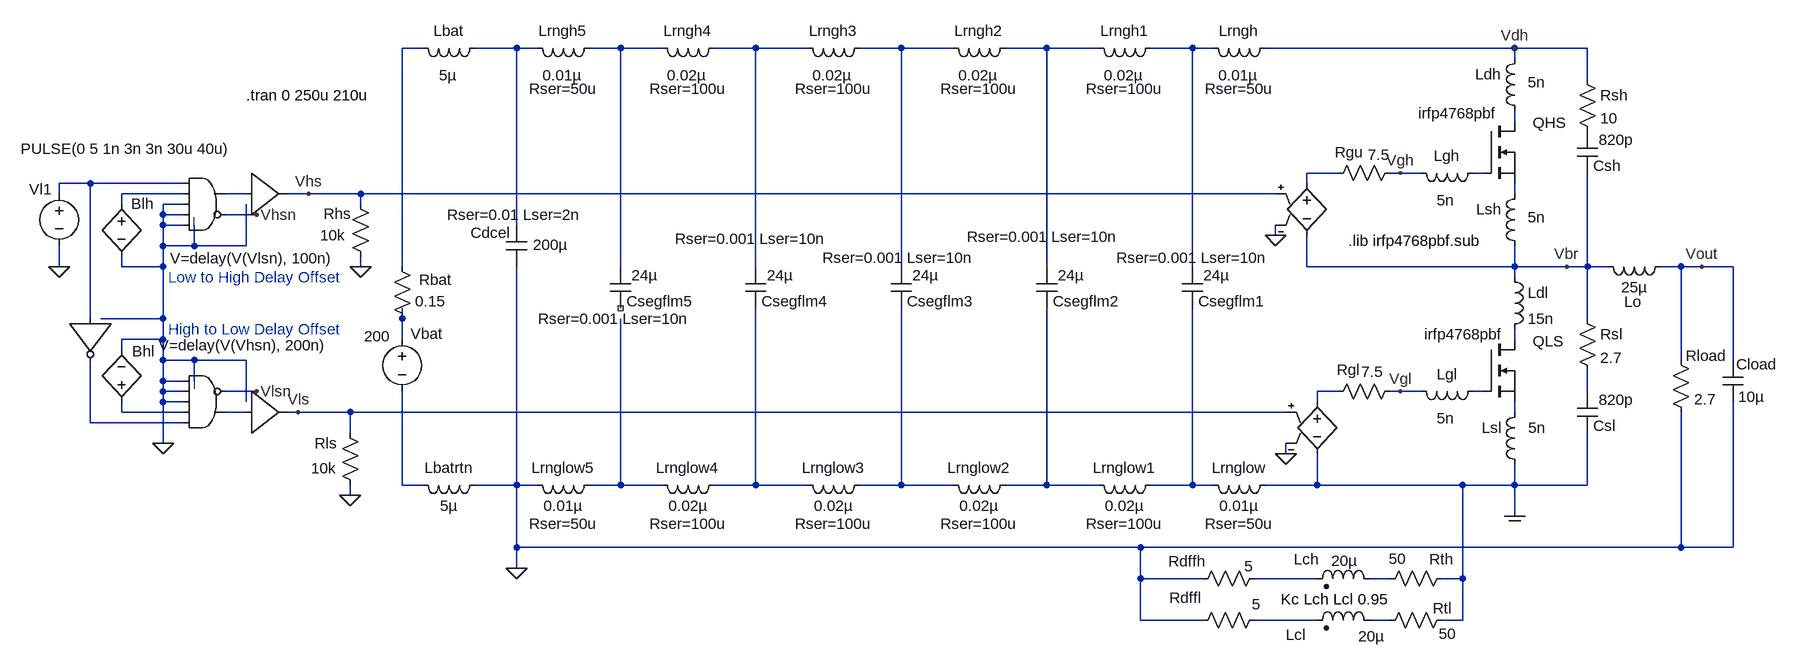
[diagram p0: schematic ETdcdcGM.asc]
ETdcdcGM.asc, the LTspice schematic file:
Version 4
SHEET 1 880 884
WIRE -3024 -240 -3056 -240
WIRE -2880 -240 -2944 -240
WIRE -2848 -240 -2880 -240
WIRE -2720 -240 -2768 -240
WIRE -2656 -240 -2720 -240
WIRE -2512 -240 -2576 -240
WIRE -2432 -240 -2512 -240
WIRE -2288 -240 -2352 -240
WIRE -2208 -240 -2288 -240
WIRE -2064 -240 -2128 -240
WIRE -1984 -240 -2064 -240
WIRE -1840 -240 -1904 -240
WIRE -1808 -240 -1840 -240
WIRE -1344 -240 -1728 -240
WIRE -1232 -240 -1344 -240
WIRE -1344 -224 -1344 -240
WIRE -1232 -192 -1232 -240
WIRE -1344 -128 -1344 -144
WIRE -1616 -48 -1664 -48
WIRE -1520 -48 -1536 -48
WIRE -1488 -48 -1520 -48
WIRE -1392 -48 -1408 -48
WIRE -3536 -32 -3584 -32
WIRE -3392 -32 -3536 -32
WIRE -1664 -32 -1664 -48
WIRE -3584 -16 -3584 -32
WIRE -3392 -16 -3488 -16
WIRE -3296 -16 -3328 -16
WIRE -3200 -16 -3232 -16
WIRE -3120 -16 -3200 -16
WIRE -1712 -16 -3120 -16
WIRE -1344 -16 -1344 -32
WIRE -3488 0 -3488 -16
WIRE -3392 0 -3424 0
WIRE -3120 0 -3120 -16
WIRE -3424 16 -3424 0
WIRE -3392 16 -3424 16
WIRE -3280 16 -3328 16
WIRE -3424 32 -3424 16
WIRE -3392 32 -3424 32
WIRE -2880 32 -2880 -240
WIRE -1712 48 -1712 32
WIRE -3424 64 -3424 32
WIRE -3376 64 -3376 32
WIRE -3376 64 -3424 64
WIRE -3296 64 -3296 0
WIRE -3296 64 -3376 64
WIRE -3584 96 -3584 64
WIRE -3488 96 -3488 80
WIRE -3424 96 -3424 64
WIRE -3424 96 -3488 96
WIRE -3120 96 -3120 80
WIRE -3056 96 -3056 -240
WIRE -2720 96 -2720 -240
WIRE -2512 96 -2512 -240
WIRE -2288 96 -2288 -240
WIRE -2064 96 -2064 -240
WIRE -1840 96 -1840 -240
WIRE -1664 96 -1664 48
WIRE -1344 96 -1344 64
WIRE -1344 96 -1664 96
WIRE -1264 96 -1344 96
WIRE -1232 96 -1232 -48
WIRE -1232 96 -1264 96
WIRE -1200 96 -1232 96
WIRE -1088 96 -1120 96
WIRE -1056 96 -1088 96
WIRE -1008 96 -1056 96
WIRE -1344 112 -1344 96
WIRE -3536 176 -3536 -32
WIRE -3424 176 -3424 96
WIRE -3424 176 -3520 176
WIRE -3056 176 -3056 160
WIRE -1232 176 -1232 96
WIRE -3424 208 -3424 176
WIRE -3424 208 -3488 208
WIRE -3056 208 -3056 176
WIRE -1344 208 -1344 192
WIRE -3488 224 -3488 208
WIRE -3424 240 -3424 208
WIRE -3376 240 -3424 240
WIRE -3296 240 -3376 240
WIRE -1088 240 -1088 96
WIRE -1008 240 -1008 96
WIRE -3424 272 -3424 240
WIRE -3392 272 -3424 272
WIRE -3376 272 -3376 240
WIRE -3424 288 -3424 272
WIRE -3392 288 -3424 288
WIRE -3280 288 -3328 288
WIRE -1616 288 -1648 288
WIRE -1520 288 -1536 288
WIRE -1488 288 -1520 288
WIRE -1392 288 -1408 288
WIRE -1232 288 -1232 256
WIRE -3424 304 -3424 288
WIRE -3392 304 -3424 304
WIRE -3296 304 -3296 240
WIRE -1648 304 -1648 288
WIRE -3488 320 -3488 304
WIRE -3392 320 -3488 320
WIRE -3296 320 -3328 320
WIRE -3216 320 -3232 320
WIRE -3136 320 -3216 320
WIRE -1696 320 -3136 320
WIRE -1344 320 -1344 304
WIRE -3536 336 -3536 240
WIRE -3392 336 -3536 336
WIRE -3136 352 -3136 320
WIRE -3424 368 -3424 304
WIRE -1696 384 -1696 368
WIRE -3056 432 -3056 288
WIRE -3024 432 -3056 432
WIRE -2880 432 -2880 96
WIRE -2880 432 -2944 432
WIRE -2848 432 -2880 432
WIRE -2720 432 -2720 176
WIRE -2720 432 -2768 432
WIRE -2656 432 -2720 432
WIRE -2512 432 -2512 160
WIRE -2512 432 -2576 432
WIRE -2432 432 -2512 432
WIRE -2288 432 -2288 160
WIRE -2288 432 -2352 432
WIRE -2208 432 -2288 432
WIRE -2064 432 -2064 160
WIRE -2064 432 -2128 432
WIRE -1984 432 -2064 432
WIRE -1840 432 -1840 160
WIRE -1840 432 -1904 432
WIRE -1808 432 -1840 432
WIRE -1648 432 -1648 384
WIRE -1648 432 -1728 432
WIRE -1424 432 -1648 432
WIRE -1344 432 -1344 400
WIRE -1344 432 -1424 432
WIRE -1232 432 -1232 352
WIRE -1232 432 -1344 432
WIRE -3136 448 -3136 432
WIRE -1344 480 -1344 432
WIRE -2880 528 -2880 432
WIRE -1920 528 -2880 528
WIRE -1088 528 -1088 320
WIRE -1088 528 -1920 528
WIRE -1008 528 -1008 304
WIRE -1008 528 -1088 528
WIRE -2880 560 -2880 528
WIRE -1920 576 -1920 528
WIRE -1824 576 -1920 576
WIRE -1648 576 -1744 576
WIRE -1536 576 -1568 576
WIRE -1424 576 -1424 432
WIRE -1424 576 -1456 576
WIRE -1920 640 -1920 576
WIRE -1824 640 -1920 640
WIRE -1648 640 -1744 640
WIRE -1536 640 -1568 640
WIRE -1424 640 -1424 576
WIRE -1424 640 -1456 640
FLAG -2880 560 0
FLAG -1056 96 Vout
FLAG -3136 448 0
FLAG -3424 368 0
FLAG -3120 96 0
FLAG -3584 96 0
FLAG -3216 320 Vls
FLAG -3200 -16 Vhs
FLAG -1712 48 0
FLAG -1696 384 0
FLAG -1344 480 COM
FLAG -1264 96 Vbr
FLAG -1520 -48 Vgh
FLAG -1520 288 Vgl
FLAG -1344 -240 Vdh
FLAG -3280 16 Vhsn
FLAG -3280 288 Vlsn
SYMBOL ind -2928 416 R90
WINDOW 0 5 56 VBottom 2
WINDOW 3 32 56 VTop 2
SYMATTR InstName Lbatrtn
SYMATTR Value 5µ
SYMATTR SpiceLine Ipk=0.21 Rser=0 Rpar=0 Cpar=0
SYMBOL voltage -3056 192 R0
WINDOW 123 0 0 Left 2
WINDOW 39 0 0 Left 2
WINDOW 0 13 7 Left 2
WINDOW 3 -59 11 Left 2
SYMATTR InstName Vbat
SYMATTR Value 200
SYMBOL ind -1360 96 R0
SYMATTR InstName Ldl
SYMATTR Value 15n
SYMBOL ind -1328 -32 M0
WINDOW 3 -31 52 Left 2
SYMATTR Value 5n
SYMATTR InstName Lsh
SYMATTR SpiceLine Rser=1m
SYMBOL res -1632 -32 R270
WINDOW 0 32 33 VTop 2
WINDOW 3 60 79 VBottom 2
SYMATTR InstName Rgu
SYMATTR Value 7.5
SYMBOL ind -1328 304 M0
WINDOW 3 -32 40 Left 2
SYMATTR Value 5n
SYMATTR InstName Lsl
SYMBOL res -1632 304 R270
WINDOW 0 34 32 VTop 2
WINDOW 3 62 69 VBottom 2
SYMATTR InstName Rgl
SYMATTR Value 7.5
SYMBOL nmos -1392 208 R0
WINDOW 0 76 3 Left 2
WINDOW 3 -91 -8 Left 2
SYMATTR InstName QLS
SYMATTR Value irfp4768pbf
SYMATTR Prefix X
SYMBOL ind -3040 -256 M90
WINDOW 0 5 56 VBottom 2
WINDOW 3 42 54 VTop 2
SYMATTR InstName Lbat
SYMATTR Value 5µ
SYMBOL ind -1216 80 M90
WINDOW 0 86 54 VBottom 2
WINDOW 3 32 56 VTop 2
SYMATTR InstName Lo
SYMATTR Value 25µ
SYMBOL res -1104 224 R0
WINDOW 0 23 9 Left 2
SYMATTR InstName Rload
SYMATTR Value 2.7
SYMBOL cap -1024 240 R0
WINDOW 0 21 6 Left 2
SYMATTR InstName Cload
SYMATTR Value 10µ
SYMBOL res -3152 336 R0
WINDOW 0 -39 32 Left 2
WINDOW 3 -44 70 Left 2
SYMATTR InstName Rls
SYMATTR Value 10k
SYMBOL res -3136 -16 R0
WINDOW 0 -41 31 Left 2
WINDOW 3 -46 64 Left 2
SYMATTR InstName Rhs
SYMATTR Value 10k
SYMBOL voltage -3584 -32 R0
WINDOW 3 -59 -53 Left 2
WINDOW 0 -46 9 Left 2
SYMATTR Value PULSE(0 5 1n 3n 3n 30u 40u)
SYMATTR InstName Vl1
SYMBOL Digital\\and -3360 -64 R0
WINDOW 0 16 24 Invisible 2
SYMATTR InstName A1
SYMATTR SpiceLine Vhigh=5 Rhigh=50 Rlow=50 Rout=50
SYMBOL Digital\\and -3360 368 M180
WINDOW 0 16 24 Invisible 2
SYMATTR InstName A2
SYMATTR SpiceLine Vhigh=5 Rhigh=50 Rlow=50 Rout=50
SYMBOL Digital\\inv -3600 176 M90
WINDOW 0 8 32 Invisible 2
SYMATTR InstName A4
SYMATTR SpiceLine Vhigh=5
SYMBOL Digital\\buf1 -3296 -80 R0
WINDOW 0 8 32 Invisible 2
SYMATTR InstName A3
SYMATTR SpiceLine Vhigh=12 Trise=60n Tfall=40n Ref=0.2
SYMBOL Digital\\buf1 -3296 384 M180
WINDOW 0 8 32 Invisible 2
SYMATTR InstName A5
SYMATTR SpiceLine Vhigh=12 Trise=60n Tfall=40n Ref=0.2
SYMBOL e -1664 -48 R0
WINDOW 0 24 16 Invisible 2
WINDOW 3 24 96 Invisible 2
SYMATTR InstName E1
SYMATTR Value 1
SYMBOL e -1648 288 R0
WINDOW 0 24 16 Invisible 2
WINDOW 3 24 96 Invisible 2
SYMATTR InstName E2
SYMATTR Value 1
SYMBOL nmos -1392 -128 R0
WINDOW 0 76 3 Left 2
WINDOW 3 -100 -12 Left 2
SYMATTR InstName QHS
SYMATTR Value irfp4768pbf
SYMATTR Prefix X
SYMBOL cap -2896 32 R0
WINDOW 0 -55 12 Left 2
WINDOW 3 41 30 Left 2
WINDOW 39 -91 -16 Left 2
SYMATTR InstName Cdcel
SYMATTR Value 200µ
SYMATTR SpiceLine Rser=0.01 Lser=2n
SYMBOL ind -1712 416 R90
WINDOW 0 5 56 VBottom 2
WINDOW 3 32 56 VTop 2
WINDOW 39 60 56 VTop 2
SYMATTR InstName Lrnglow
SYMATTR Value 0.01µ
SYMATTR SpiceLine Rser=50u
SYMBOL ind -1824 -256 M90
WINDOW 0 5 56 VBottom 2
WINDOW 3 42 54 VTop 2
WINDOW 39 94 56 VBottom 2
SYMATTR InstName Lrngh
SYMATTR Value 0.01µ
SYMATTR SpiceLine Rser=50u
SYMBOL cap -1856 96 R0
WINDOW 0 25 53 Left 2
WINDOW 3 33 13 Left 2
WINDOW 39 -101 -14 Left 2
SYMATTR InstName Csegflm1
SYMATTR Value 24µ
SYMATTR SpiceLine Rser=0.001 Lser=10n
SYMBOL ind -1888 416 R90
WINDOW 0 5 56 VBottom 2
WINDOW 3 32 56 VTop 2
WINDOW 39 60 56 VTop 2
SYMATTR InstName Lrnglow1
SYMATTR Value 0.02µ
SYMATTR SpiceLine Rser=100u
SYMBOL ind -2000 -256 M90
WINDOW 0 5 56 VBottom 2
WINDOW 3 42 54 VTop 2
WINDOW 39 94 56 VBottom 2
SYMATTR InstName Lrngh1
SYMATTR Value 0.02µ
SYMATTR SpiceLine Rser=100u
SYMBOL cap -2080 96 R0
WINDOW 0 25 53 Left 2
WINDOW 3 33 13 Left 2
WINDOW 39 -107 -46 Left 2
SYMATTR InstName Csegflm2
SYMATTR Value 24µ
SYMATTR SpiceLine Rser=0.001 Lser=10n
SYMBOL cap -2304 96 R0
WINDOW 0 25 53 Left 2
WINDOW 3 33 13 Left 2
WINDOW 39 -105 -14 Left 2
SYMATTR InstName Csegflm3
SYMATTR Value 24µ
SYMATTR SpiceLine Rser=0.001 Lser=10n
SYMBOL cap -2528 96 R0
WINDOW 0 25 53 Left 2
WINDOW 3 33 13 Left 2
WINDOW 39 -108 -43 Left 2
SYMATTR InstName Csegflm4
SYMATTR Value 24µ
SYMATTR SpiceLine Rser=0.001 Lser=10n
SYMBOL cap -2736 96 R0
WINDOW 0 25 53 Left 2
WINDOW 3 33 13 Left 2
WINDOW 39 -111 80 Left 2
SYMATTR InstName Csegflm5
SYMATTR Value 24µ
SYMATTR SpiceLine Rser=0.001 Lser=10n
SYMBOL ind -2224 -256 M90
WINDOW 0 5 56 VBottom 2
WINDOW 3 42 54 VTop 2
WINDOW 39 94 56 VBottom 2
SYMATTR InstName Lrngh2
SYMATTR Value 0.02µ
SYMATTR SpiceLine Rser=100u
SYMBOL ind -2448 -256 M90
WINDOW 0 5 56 VBottom 2
WINDOW 3 42 54 VTop 2
WINDOW 39 94 56 VBottom 2
SYMATTR InstName Lrngh3
SYMATTR Value 0.02µ
SYMATTR SpiceLine Rser=100u
SYMBOL ind -2672 -256 M90
WINDOW 0 5 56 VBottom 2
WINDOW 3 42 54 VTop 2
WINDOW 39 94 56 VBottom 2
SYMATTR InstName Lrngh4
SYMATTR Value 0.02µ
SYMATTR SpiceLine Rser=100u
SYMBOL ind -2864 -256 M90
WINDOW 0 5 56 VBottom 2
WINDOW 3 42 54 VTop 2
WINDOW 39 94 56 VBottom 2
SYMATTR InstName Lrngh5
SYMATTR Value 0.01µ
SYMATTR SpiceLine Rser=50u
SYMBOL ind -2112 416 R90
WINDOW 0 5 56 VBottom 2
WINDOW 3 32 56 VTop 2
WINDOW 39 60 56 VTop 2
SYMATTR InstName Lrnglow2
SYMATTR Value 0.02µ
SYMATTR SpiceLine Rser=100u
SYMBOL ind -2336 416 R90
WINDOW 0 5 56 VBottom 2
WINDOW 3 32 56 VTop 2
WINDOW 39 60 56 VTop 2
SYMATTR InstName Lrnglow3
SYMATTR Value 0.02µ
SYMATTR SpiceLine Rser=100u
SYMBOL ind -2560 416 R90
WINDOW 0 5 56 VBottom 2
WINDOW 3 32 56 VTop 2
WINDOW 39 60 56 VTop 2
SYMATTR InstName Lrnglow4
SYMATTR Value 0.02µ
SYMATTR SpiceLine Rser=100u
SYMBOL ind -2752 416 R90
WINDOW 0 5 56 VBottom 2
WINDOW 3 32 56 VTop 2
WINDOW 39 60 56 VTop 2
SYMATTR InstName Lrnglow5
SYMATTR Value 0.01µ
SYMATTR SpiceLine Rser=50u
SYMBOL ind -1328 -240 M0
WINDOW 3 -31 52 Left 2
SYMATTR Value 5n
SYMATTR InstName Ldh
SYMATTR SpiceLine Rser=1m
SYMBOL ind -1504 -64 M90
WINDOW 0 5 56 VBottom 2
WINDOW 3 42 54 VTop 2
WINDOW 39 94 56 VBottom 2
SYMATTR InstName Lgh
SYMATTR Value 5n
SYMBOL ind -1504 272 M90
WINDOW 0 5 56 VBottom 2
WINDOW 3 42 54 VTop 2
WINDOW 39 94 56 VBottom 2
SYMATTR InstName Lgl
SYMATTR Value 5n
SYMBOL res -3072 80 R0
WINDOW 0 42 36 Left 2
WINDOW 3 36 69 Left 2
SYMATTR InstName Rbat
SYMATTR Value 0.15
SYMBOL res -1248 -208 R0
SYMATTR InstName Rsh
SYMATTR Value 10
SYMBOL cap -1248 -112 R0
WINDOW 0 25 53 Left 2
WINDOW 3 33 13 Left 2
SYMATTR InstName Csh
SYMATTR Value 820p
SYMBOL res -1248 160 R0
SYMATTR InstName Rsl
SYMATTR Value 2.7
SYMBOL cap -1248 288 R0
WINDOW 0 25 53 Left 2
WINDOW 3 33 13 Left 2
SYMATTR InstName Csl
SYMATTR Value 820p
SYMBOL res -1440 560 R90
WINDOW 0 2 17 VBottom 2
WINDOW 3 -30 84 VTop 2
SYMATTR InstName Rth
SYMATTR Value 50
SYMBOL res -1552 656 R270
WINDOW 0 19 97 VTop 2
WINDOW 3 11 105 VBottom 2
SYMATTR InstName Rtl
SYMATTR Value 50
SYMBOL res -1728 560 R90
WINDOW 0 5 120 VBottom 2
WINDOW 3 -19 25 VTop 2
SYMATTR InstName Rdffh
SYMATTR Value 5
SYMBOL res -1728 624 R90
WINDOW 0 -3 123 VBottom 2
WINDOW 3 -24 14 VTop 2
SYMATTR InstName Rdffl
SYMATTR Value 5
SYMBOL ind2 -1552 592 M270
WINDOW 0 30 112 VTop 2
WINDOW 3 59 54 VBottom 2
SYMATTR InstName Lch
SYMATTR Value 20µ
SYMATTR SpiceLine Rser=1m
SYMATTR Type ind
SYMBOL ind2 -1552 656 M270
WINDOW 0 -22 129 VTop 2
WINDOW 3 7 12 VBottom 2
SYMATTR InstName Lcl
SYMATTR Value 20µ
SYMATTR SpiceLine Rser=1m
SYMATTR Type ind
SYMBOL bv -3488 -16 R0
WINDOW 0 15 15 Left 2
WINDOW 3 75 99 Left 2
SYMATTR InstName Blh
SYMATTR Value V=delay(V(Vlsn), 100n)
SYMBOL bv -3488 320 R180
WINDOW 0 -51 94 Left 2
WINDOW 3 -316 103 Left 2
SYMATTR InstName Bhl
SYMATTR Value V=delay(V(Vhsn), 200n)
TEXT -3296 -168 Left 2 !.tran 0 250u 210u
TEXT -1600 56 Left 2 !.lib irfp4768pbf.sub
TEXT -3416 192 Left 2 ;High to Low Delay Offset
TEXT -3416 112 Left 2 ;Low to High Delay Offset
TEXT -1704 608 Left 2 !Kc Lch Lcl 0.95

The netlist it stands for:
* ETdcdcGM.asc
Lbatrtn 0 N024 5µ Ipk=0.21 Rser=0 Rpar=0 Cpar=0
Vbat N015 N024 200
Ldl Vbr N016 15n
Lsh N014 Vbr 5n Rser=1m
Rgu N009 Vgh 7.5
Lsl N022 COM 5n
Rgl N017 Vgl 7.5
XQLS N016 N018 N022 irfp4768pbf  ; pins D G S
Lbat N001 N002 5µ
Lo Vbr Vout 25µ
Rload Vout 0 2.7
Cload Vout 0 10µ
Rls Vls 0 10k
Rhs Vhs 0 10k
Vl1 N011 0 PULSE(0 5 1n 3n 3n 30u 40u)
A1 N011 N012 0 0 0 Vhsn N013 0 AND Vhigh=5 Rhigh=50 Rlow=50 Rout=50
A2 N023 N020 0 0 0 Vlsn N021 0 AND Vhigh=5 Rhigh=50 Rlow=50 Rout=50
A4 N011 0 0 0 0 N023 0 0 BUF Vhigh=5
A3 N013 0 0 0 0 0 Vhs 0 BUF Vhigh=12 Trise=60n Tfall=40n Ref=0.2
A5 N021 0 0 0 0 0 Vls 0 BUF Vhigh=12 Trise=60n Tfall=40n Ref=0.2
E1 N009 Vbr Vhs 0 1
E2 N017 COM Vls 0 1
XQHS N008 N010 N014 irfp4768pbf  ; pins D G S
Cdcel N002 0 200µ Rser=0.01 Lser=2n
Lrnglow COM N029 0.01µ Rser=50u
Lrngh N007 Vdh 0.01µ Rser=50u
Csegflm1 N007 N029 24µ Rser=0.001 Lser=10n
Lrnglow1 N029 N028 0.02µ Rser=100u
Lrngh1 N006 N007 0.02µ Rser=100u
Csegflm2 N006 N028 24µ Rser=0.001 Lser=10n
Csegflm3 N005 N027 24µ Rser=0.001 Lser=10n
Csegflm4 N004 N026 24µ Rser=0.001 Lser=10n
Csegflm5 N003 NC_01 24µ Rser=0.001 Lser=10n
Lrngh2 N005 N006 0.02µ Rser=100u
Lrngh3 N004 N005 0.02µ Rser=100u
Lrngh4 N003 N004 0.02µ Rser=100u
Lrngh5 N002 N003 0.01µ Rser=50u
Lrnglow2 N028 N027 0.02µ Rser=100u
Lrnglow3 N027 N026 0.02µ Rser=100u
Lrnglow4 N026 N025 0.02µ Rser=100u
Lrnglow5 N025 0 0.01µ Rser=50u
Ldh Vdh N008 5n Rser=1m
Lgh Vgh N010 5n
Lgl Vgl N018 5n
Rbat N001 N015 0.15
Rsh Vdh P001 10
Csh P001 Vbr 820p
Rsl Vbr N019 2.7
Csl N019 COM 820p
Rth COM N031 50
Rtl N033 COM 50
Rdffh N030 0 5
Rdffl N032 0 5
Lch N031 N030 20µ Rser=1m
Lcl N033 N032 20µ Rser=1m
Blh N012 0 V=delay(V(Vlsn), 100n)
Bhl N020 0 V=delay(V(Vhsn), 200n)
.tran 0 250u 210u
.lib irfp4768pbf.sub
* High to Low Delay Offset
* Low to High Delay Offset
Kc Lch Lcl 0.95
.backanno
.end